# EAGLE schematic angle (EAGLE 9.2.2)
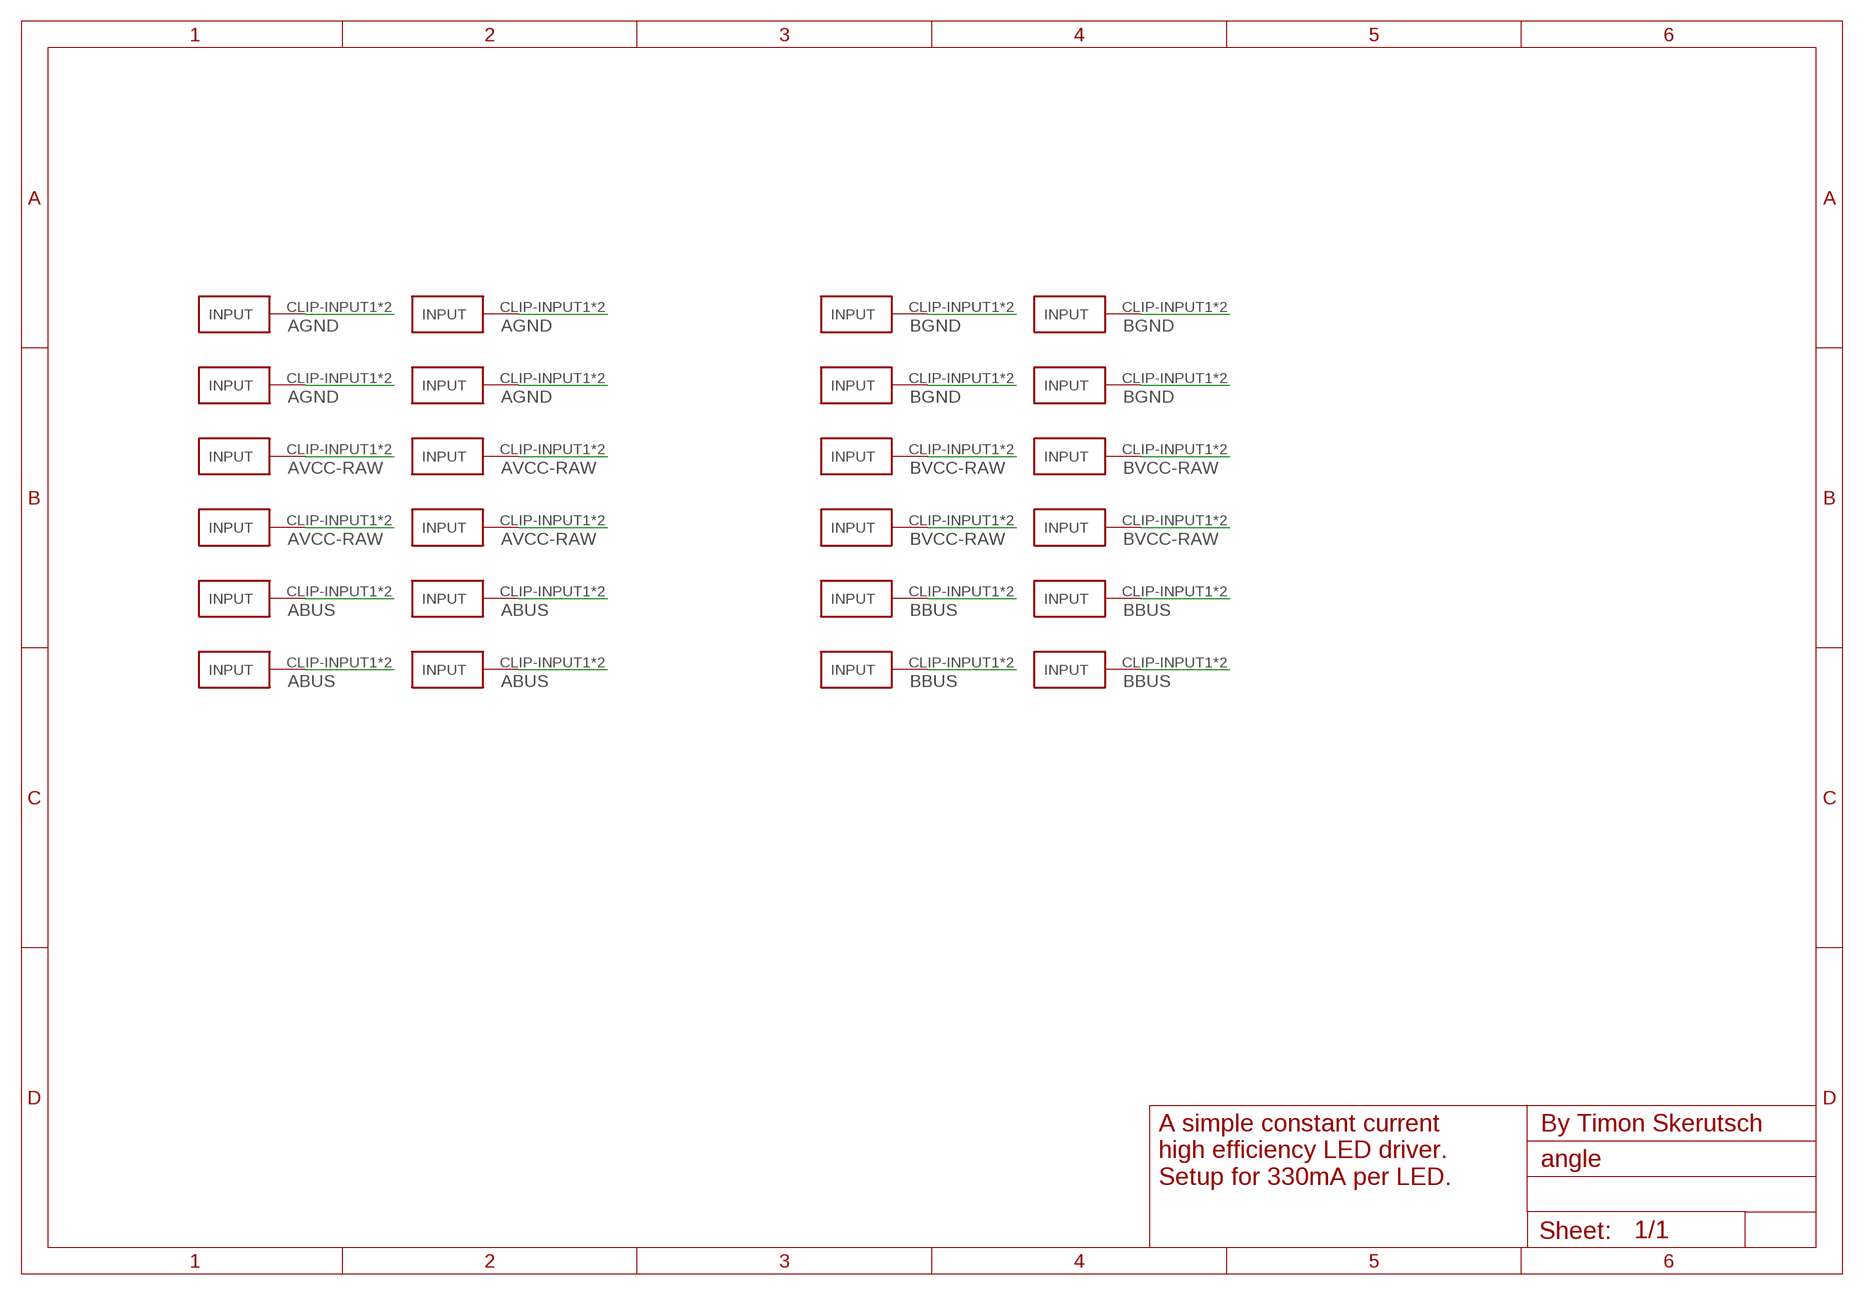
[diagram p0: schematic, sheet 1]

## Parts
ABUS-CLIP  FUSE-HOLDER-5X20MM  [FUSE-HOLDER-5X20MM]
ABUS-CLIP1  FUSE-HOLDER-5X20MM  [FUSE-HOLDER-5X20MM]
ABUS-CLIP2  FUSE-HOLDER-5X20MM  [FUSE-HOLDER-5X20MM]
ABUS-CLIP3  FUSE-HOLDER-5X20MM  [FUSE-HOLDER-5X20MM]
AGND-CLIP  FUSE-HOLDER-5X20MM  [FUSE-HOLDER-5X20MM]
AGND-CLIP1  FUSE-HOLDER-5X20MM  [FUSE-HOLDER-5X20MM]
AGND-CLIP2  FUSE-HOLDER-5X20MM  [FUSE-HOLDER-5X20MM]
AGND-CLIP3  FUSE-HOLDER-5X20MM  [FUSE-HOLDER-5X20MM]
AVCC-CLIP  FUSE-HOLDER-5X20MM  [FUSE-HOLDER-5X20MM]
AVCC-CLIP1  FUSE-HOLDER-5X20MM  [FUSE-HOLDER-5X20MM]
AVCC-CLIP2  FUSE-HOLDER-5X20MM  [FUSE-HOLDER-5X20MM]
AVCC-CLIP3  FUSE-HOLDER-5X20MM  [FUSE-HOLDER-5X20MM]
BBUS-CLIP  FUSE-HOLDER-5X20MM  [FUSE-HOLDER-5X20MM]
BBUS-CLIP1  FUSE-HOLDER-5X20MM  [FUSE-HOLDER-5X20MM]
BBUS-CLIP2  FUSE-HOLDER-5X20MM  [FUSE-HOLDER-5X20MM]
BBUS-CLIP3  FUSE-HOLDER-5X20MM  [FUSE-HOLDER-5X20MM]
BGND-CLIP  FUSE-HOLDER-5X20MM  [FUSE-HOLDER-5X20MM]
BGND-CLIP1  FUSE-HOLDER-5X20MM  [FUSE-HOLDER-5X20MM]
BGND-CLIP2  FUSE-HOLDER-5X20MM  [FUSE-HOLDER-5X20MM]
BGND-CLIP3  FUSE-HOLDER-5X20MM  [FUSE-HOLDER-5X20MM]
BVCC-CLIP  FUSE-HOLDER-5X20MM  [FUSE-HOLDER-5X20MM]
BVCC-CLIP1  FUSE-HOLDER-5X20MM  [FUSE-HOLDER-5X20MM]
BVCC-CLIP2  FUSE-HOLDER-5X20MM  [FUSE-HOLDER-5X20MM]
BVCC-CLIP3  FUSE-HOLDER-5X20MM  [FUSE-HOLDER-5X20MM]

## Nets
ABUS: ABUS-CLIP1.CLIP-INPUT1(INPUT) ABUS-CLIP1.CLIP-INPUT2(INPUT) ABUS-CLIP2.CLIP-INPUT1(INPUT) ABUS-CLIP2.CLIP-INPUT2(INPUT) ABUS-CLIP3.CLIP-INPUT1(INPUT) ABUS-CLIP3.CLIP-INPUT2(INPUT) ABUS-CLIP.CLIP-INPUT1(INPUT) ABUS-CLIP.CLIP-INPUT2(INPUT)
AGND: AGND-CLIP1.CLIP-INPUT1(INPUT) AGND-CLIP1.CLIP-INPUT2(INPUT) AGND-CLIP2.CLIP-INPUT1(INPUT) AGND-CLIP2.CLIP-INPUT2(INPUT) AGND-CLIP3.CLIP-INPUT1(INPUT) AGND-CLIP3.CLIP-INPUT2(INPUT) AGND-CLIP.CLIP-INPUT1(INPUT) AGND-CLIP.CLIP-INPUT2(INPUT)
AVCC-RAW [VCC]: AVCC-CLIP1.CLIP-INPUT1(INPUT) AVCC-CLIP1.CLIP-INPUT2(INPUT) AVCC-CLIP2.CLIP-INPUT1(INPUT) AVCC-CLIP2.CLIP-INPUT2(INPUT) AVCC-CLIP3.CLIP-INPUT1(INPUT) AVCC-CLIP3.CLIP-INPUT2(INPUT) AVCC-CLIP.CLIP-INPUT1(INPUT) AVCC-CLIP.CLIP-INPUT2(INPUT)
BBUS: BBUS-CLIP1.CLIP-INPUT1(INPUT) BBUS-CLIP1.CLIP-INPUT2(INPUT) BBUS-CLIP2.CLIP-INPUT1(INPUT) BBUS-CLIP2.CLIP-INPUT2(INPUT) BBUS-CLIP3.CLIP-INPUT1(INPUT) BBUS-CLIP3.CLIP-INPUT2(INPUT) BBUS-CLIP.CLIP-INPUT1(INPUT) BBUS-CLIP.CLIP-INPUT2(INPUT)
BGND: BGND-CLIP1.CLIP-INPUT1(INPUT) BGND-CLIP1.CLIP-INPUT2(INPUT) BGND-CLIP2.CLIP-INPUT1(INPUT) BGND-CLIP2.CLIP-INPUT2(INPUT) BGND-CLIP3.CLIP-INPUT1(INPUT) BGND-CLIP3.CLIP-INPUT2(INPUT) BGND-CLIP.CLIP-INPUT1(INPUT) BGND-CLIP.CLIP-INPUT2(INPUT)
BVCC-RAW [VCC]: BVCC-CLIP1.CLIP-INPUT1(INPUT) BVCC-CLIP1.CLIP-INPUT2(INPUT) BVCC-CLIP2.CLIP-INPUT1(INPUT) BVCC-CLIP2.CLIP-INPUT2(INPUT) BVCC-CLIP3.CLIP-INPUT1(INPUT) BVCC-CLIP3.CLIP-INPUT2(INPUT) BVCC-CLIP.CLIP-INPUT1(INPUT) BVCC-CLIP.CLIP-INPUT2(INPUT)

## Notes on the sheet
- By Timon Skerutsch
- A simple constant current
  high efficiency LED driver.
  Setup for 330mA per LED.

## Library data of the parts
ABUS-CLIP ABUS-CLIP1-ABUS-CLIP3 AGND-CLIP AGND-CLIP1-AGND-CLIP3 AVCC-CLIP AVCC-CLIP1-AVCC-CLIP3 BBUS-CLIP BBUS-CLIP1-BBUS-CLIP3 BGND-CLIP BGND-CLIP1-BGND-CLIP3 BVCC-CLIP BVCC-CLIP1-BVCC-CLIP3 = timon-diverses:FUSE-HOLDER-5X20MM

## Net classes
1 VCC: clearance 0.508 mm